# Altium schematic sheet VFD_alpha_Sheet3.SchDoc
size A4
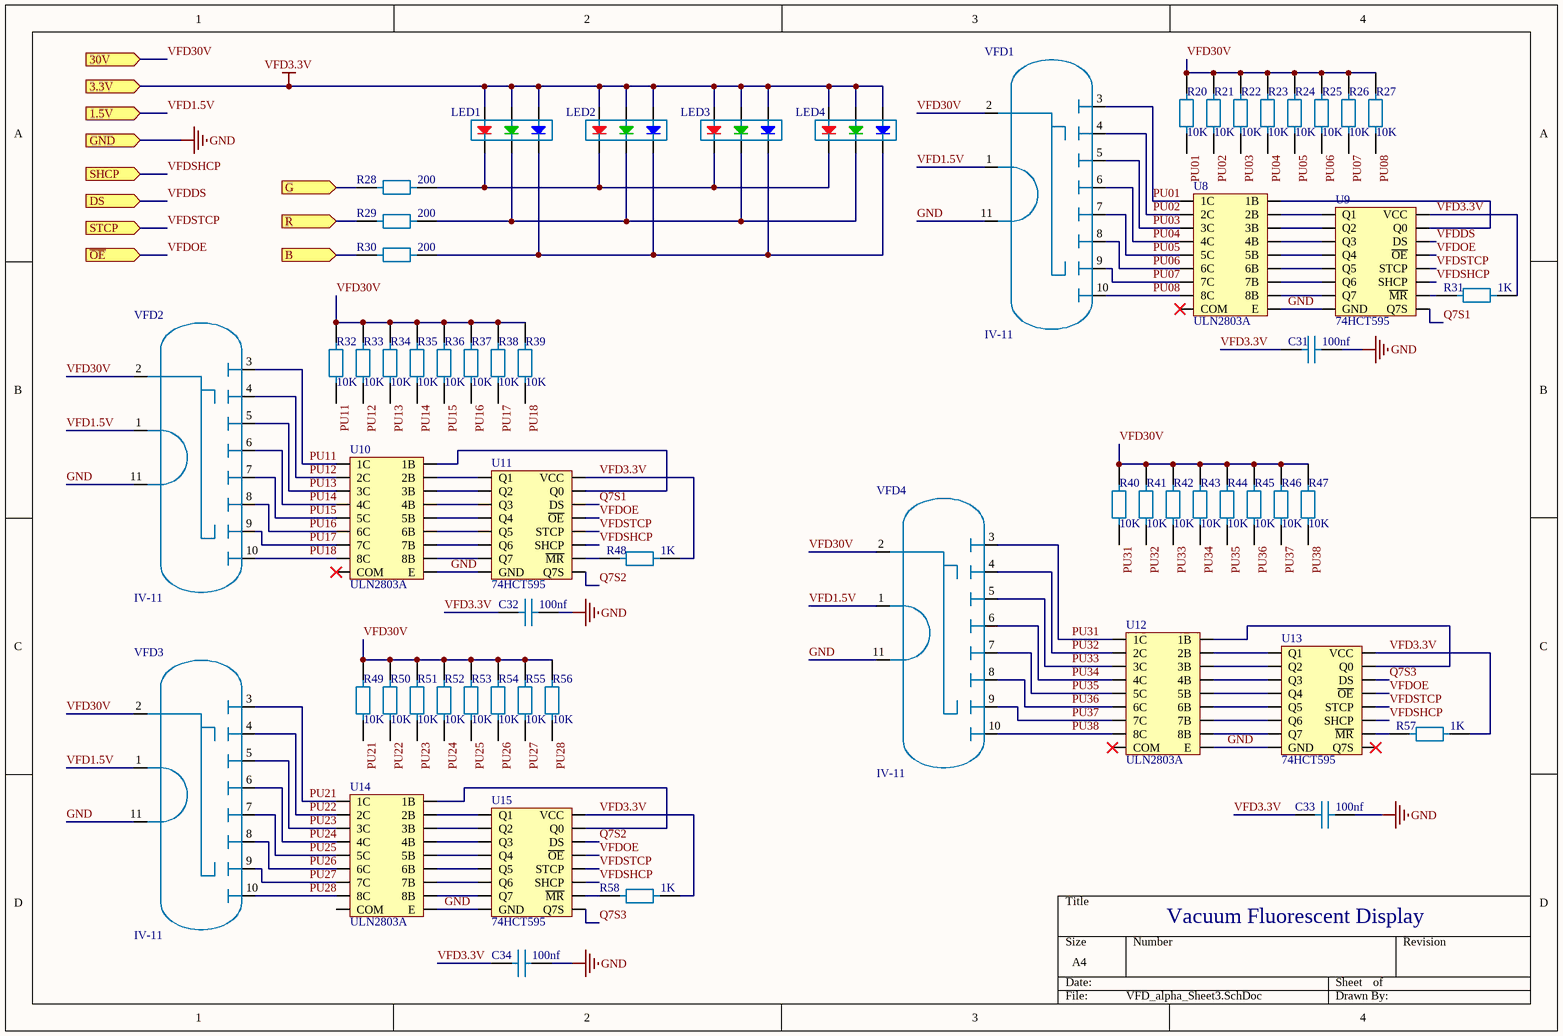
[diagram p0: VFD_alpha_Sheet3.SchDoc]

## Parts
C31  value 100nf  [0603]  (hidden comment: C)
C32  value 100nf  [0603]  (hidden comment: C)
C33  value 100nf  [0603]  (hidden comment: C)
C34  value 100nf  [0603]  (hidden comment: C)
LED1  RGBLED  [RGBLED]  (value not drawn)
LED2  RGBLED  [RGBLED]  (value not drawn)
LED3  RGBLED  [RGBLED]  (value not drawn)
LED4  RGBLED  [RGBLED]  (value not drawn)
R20  value 10K  [R-1/4W]  (hidden comment: R(1/4W))
R21  value 10K  [R-1/4W]  (hidden comment: R(1/4W))
R22  value 10K  [R-1/4W]  (hidden comment: R(1/4W))
R23  value 10K  [R-1/4W]  (hidden comment: R(1/4W))
R24  value 10K  [R-1/4W]  (hidden comment: R(1/4W))
R25  value 10K  [R-1/4W]  (hidden comment: R(1/4W))
R26  value 10K  [R-1/4W]  (hidden comment: R(1/4W))
R27  value 10K  [R-1/4W]  (hidden comment: R(1/4W))
R28  value 200  [0603]  (hidden comment: R)
R29  value 200  [0603]  (hidden comment: R)
R30  value 200  [0603]  (hidden comment: R)
R31  value 1K  [0603]  (hidden comment: R)
R32  value 10K  [R-1/4W]  (hidden comment: R(1/4W))
R33  value 10K  [R-1/4W]  (hidden comment: R(1/4W))
R34  value 10K  [R-1/4W]  (hidden comment: R(1/4W))
R35  value 10K  [R-1/4W]  (hidden comment: R(1/4W))
R36  value 10K  [R-1/4W]  (hidden comment: R(1/4W))
R37  value 10K  [R-1/4W]  (hidden comment: R(1/4W))
R38  value 10K  [R-1/4W]  (hidden comment: R(1/4W))
R39  value 10K  [R-1/4W]  (hidden comment: R(1/4W))
R40  value 10K  [R-1/4W]  (hidden comment: R(1/4W))
R41  value 10K  [R-1/4W]  (hidden comment: R(1/4W))
R42  value 10K  [R-1/4W]  (hidden comment: R(1/4W))
R43  value 10K  [R-1/4W]  (hidden comment: R(1/4W))
R44  value 10K  [R-1/4W]  (hidden comment: R(1/4W))
R45  value 10K  [R-1/4W]  (hidden comment: R(1/4W))
R46  value 10K  [R-1/4W]  (hidden comment: R(1/4W))
R47  value 10K  [R-1/4W]  (hidden comment: R(1/4W))
R48  value 1K  [0603]  (hidden comment: R)
R49  value 10K  [R-1/4W]  (hidden comment: R(1/4W))
R50  value 10K  [R-1/4W]  (hidden comment: R(1/4W))
R51  value 10K  [R-1/4W]  (hidden comment: R(1/4W))
R52  value 10K  [R-1/4W]  (hidden comment: R(1/4W))
R53  value 10K  [R-1/4W]  (hidden comment: R(1/4W))
R54  value 10K  [R-1/4W]  (hidden comment: R(1/4W))
R55  value 10K  [R-1/4W]  (hidden comment: R(1/4W))
R56  value 10K  [R-1/4W]  (hidden comment: R(1/4W))
R57  value 1K  [0603]  (hidden comment: R)
R58  value 1K  [0603]  (hidden comment: R)
U8  ULN2803A  [SOIC-18P]
U9  74HCT595  [SOIC-16P]
U10  ULN2803A  [SOIC-18P]
U11  74HCT595  [SOIC-16P]
U12  ULN2803A  [SOIC-18P]
U13  74HCT595  [SOIC-16P]
U14  ULN2803A  [SOIC-18P]
U15  74HCT595  [SOIC-16P]
VFD1  IV-11  [IV-11]
VFD2  IV-11  [IV-11]
VFD3  IV-11  [IV-11]
VFD4  IV-11  [IV-11]

## Ports
1.5V (in), 3.3V (in), 30V (in), B (in), DS (in), G (in), GND (in), R (in), SHCP (in), STCP (in), ~{OE} (in)

## Nets
GND: C31.1 C32.2 C33.2 C34.2 U8.9(E) U9.8(GND) U10.9(E) U11.8(GND) U12.9(E) U13.8(GND) U14.9(E) U15.8(GND) VFD1.11 VFD2.11 VFD3.11 VFD4.11 ; port GND
VFD3.3V: C31.2 C32.1 C33.1 C34.1 LED1.1 LED1.2 LED1.3 LED2.1 LED2.2 LED2.3 LED3.1 LED3.2 LED3.3 LED4.1 LED4.2 LED4.3 R31.2 R48.2 R57.2 R58.2 U9.16(VCC) U11.16(VCC) U13.16(VCC) U15.16(VCC) ; port 3.3V
B: R30.2 ; port B
G: R28.2 ; port G
PU01: R20.1 U8.18(1C) VFD1.3
PU02: R21.1 U8.17(2C) VFD1.4
PU03: R22.1 U8.16(3C) VFD1.5
PU04: R23.1 U8.15(4C) VFD1.6
PU05: R24.1 U8.14(5C) VFD1.7
PU06: R25.1 U8.13(6C) VFD1.8
PU07: R26.1 U8.12(7C) VFD1.9
PU08: R27.1 U8.11(8C) VFD1.10
PU11: R32.1 U10.18(1C) VFD2.3
PU12: R33.1 U10.17(2C) VFD2.4
PU13: R34.1 U10.16(3C) VFD2.5
PU14: R35.1 U10.15(4C) VFD2.6
PU15: R36.1 U10.14(5C) VFD2.7
PU16: R37.1 U10.13(6C) VFD2.8
PU17: R38.1 U10.12(7C) VFD2.9
PU18: R39.1 U10.11(8C) VFD2.10
PU21: R49.1 U14.18(1C) VFD3.3
PU22: R50.1 U14.17(2C) VFD3.4
PU23: R51.1 U14.16(3C) VFD3.5
PU24: R52.1 U14.15(4C) VFD3.6
PU25: R53.1 U14.14(5C) VFD3.7
PU26: R54.1 U14.13(6C) VFD3.8
PU27: R55.1 U14.12(7C) VFD3.9
PU28: R56.1 U14.11(8C) VFD3.10
PU31: R40.1 U12.18(1C) VFD4.3
PU32: R41.1 U12.17(2C) VFD4.4
PU33: R42.1 U12.16(3C) VFD4.5
PU34: R43.1 U12.15(4C) VFD4.6
PU35: R44.1 U12.14(5C) VFD4.7
PU36: R45.1 U12.13(6C) VFD4.8
PU37: R46.1 U12.12(7C) VFD4.9
PU38: R47.1 U12.11(8C) VFD4.10
Q7S1: U9.9(Q7S) U11.14(DS)
Q7S2: U11.9(Q7S) U15.14(DS)
Q7S3: U13.14(DS) U15.9(Q7S)
R: R29.2 ; port R
VFD1.5V: VFD1.1 VFD2.1 VFD3.1 VFD4.1 ; port 1.5V
VFD30V: R20.2 R21.2 R22.2 R23.2 R24.2 R25.2 R26.2 R27.2 R32.2 R33.2 R34.2 R35.2 R36.2 R37.2 R38.2 R39.2 R40.2 R41.2 R42.2 R43.2 R44.2 R45.2 R46.2 R47.2 R49.2 R50.2 R51.2 R52.2 R53.2 R54.2 R55.2 R56.2 VFD1.2 VFD2.2 VFD3.2 VFD4.2 ; port 30V
VFDDS: U9.14(DS) ; port DS
VFDOE: U9.13(~{OE}) U11.13(~{OE}) U13.13(~{OE}) U15.13(~{OE}) ; port ~{OE}
VFDSHCP: U9.11(SHCP) U11.11(SHCP) U13.11(SHCP) U15.11(SHCP) ; port SHCP
VFDSTCP: U9.12(STCP) U11.12(STCP) U13.12(STCP) U15.12(STCP) ; port STCP
NetLED1_4: LED1.4 LED2.4 LED3.4 LED4.4 R30.1
NetLED1_5: LED1.5 LED2.5 LED3.5 LED4.5 R29.1
NetLED1_6: LED1.6 LED2.6 LED3.6 LED4.6 R28.1
NetR31_1: R31.1 U9.10(~{MR})
NetR48_1: R48.1 U11.10(~{MR})
NetR57_1: R57.1 U13.10(~{MR})
NetR58_1: R58.1 U15.10(~{MR})
NetU8_1: U8.1(1B) U9.15(Q0)
NetU8_2: U8.2(2B) U9.1(Q1)
NetU8_3: U8.3(3B) U9.2(Q2)
NetU8_4: U8.4(4B) U9.3(Q3)
NetU8_5: U8.5(5B) U9.4(Q4)
NetU8_6: U8.6(6B) U9.5(Q5)
NetU8_7: U8.7(7B) U9.6(Q6)
NetU8_8: U8.8(8B) U9.7(Q7)
NetU10_1: U10.1(1B) U11.15(Q0)
NetU10_2: U10.2(2B) U11.1(Q1)
NetU10_3: U10.3(3B) U11.2(Q2)
NetU10_4: U10.4(4B) U11.3(Q3)
NetU10_5: U10.5(5B) U11.4(Q4)
NetU10_6: U10.6(6B) U11.5(Q5)
NetU10_7: U10.7(7B) U11.6(Q6)
NetU10_8: U10.8(8B) U11.7(Q7)
NetU12_1: U12.1(1B) U13.15(Q0)
NetU12_2: U12.2(2B) U13.1(Q1)
NetU12_3: U12.3(3B) U13.2(Q2)
NetU12_4: U12.4(4B) U13.3(Q3)
NetU12_5: U12.5(5B) U13.4(Q4)
NetU12_6: U12.6(6B) U13.5(Q5)
NetU12_7: U12.7(7B) U13.6(Q6)
NetU12_8: U12.8(8B) U13.7(Q7)
NetU14_1: U14.1(1B) U15.15(Q0)
NetU14_2: U14.2(2B) U15.1(Q1)
NetU14_3: U14.3(3B) U15.2(Q2)
NetU14_4: U14.4(4B) U15.3(Q3)
NetU14_5: U14.5(5B) U15.4(Q4)
NetU14_6: U14.6(6B) U15.5(Q5)
NetU14_7: U14.7(7B) U15.6(Q6)
NetU14_8: U14.8(8B) U15.7(Q7)

Not connected (* = marked no-connect by the designer): U8 10(COM)*; U10 10(COM)*; U12 10(COM)*; U13 9(Q7S)*; U14 10(COM)

## Notes on the sheet
- Vacuum Fluorescent Display

## Library data of the parts
C31-C34 = C(0603)
R28-R31 R48 R57 R58 = R(0603)